# Altium project DryBox.PrjPcb
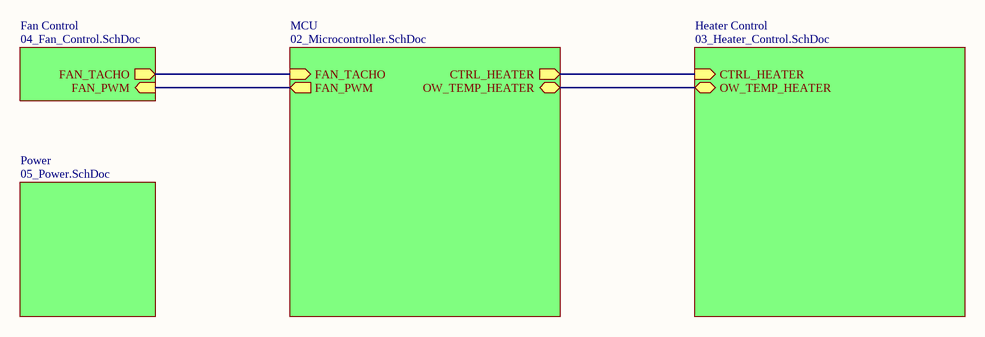
[diagram p0: 01_Top.SchDoc]
revision: 1.0; sk_ProjectName: DIY Dry Box
3 sheets, 36 parts. Net scope: hierarchical (ports join the sheet entries above them; power ports are global).
Board file: DryBox.PcbDoc
Sheets:
  01_Top.SchDoc
    MCU = 02_Microcontroller.SchDoc
    Power = 05_Power.SchDoc

## Sheet 01_Top.SchDoc
size A4; Author: Sasa Karanovic; Organization: Altium Limited; sk_Title: Block diagram; DocumentNumber: 1; Revision: 1.0; SheetNumber: 1; SheetTotal: 5

### Sub-sheets
Fan Control = 04_Fan_Control.SchDoc (file not in this document): FAN_TACHO (out), FAN_PWM (in)
Heater Control = 03_Heater_Control.SchDoc (file not in this document): CTRL_HEATER (in), OW_TEMP_HEATER (bidir)
MCU = 02_Microcontroller.SchDoc: CTRL_HEATER (out), FAN_TACHO (in), FAN_PWM (out), OW_TEMP_HEATER (bidir)
Power = 05_Power.SchDoc: no entries

### Nets
CTRL_HEATER: sheet MCU/CTRL_HEATER, sheet Heater Control/CTRL_HEATER
FAN_PWM: sheet MCU/FAN_PWM, sheet Fan Control/FAN_PWM
FAN_TACHO: sheet MCU/FAN_TACHO, sheet Fan Control/FAN_TACHO
OW_TEMP_HEATER: sheet MCU/OW_TEMP_HEATER, sheet Heater Control/OW_TEMP_HEATER

### Notes on the sheet
- Page
- Title
- www.SasaKaranovic.com <http://www.SasaKaranovic.com>
- of

## Sheet 02_Microcontroller.SchDoc
size A4; Author: Sasa Karanovic; Organization: Altium Limited; sk_Title: Microcontroller; DocumentNumber: 1; Revision: 1.0; SheetNumber: 2; SheetTotal: 5
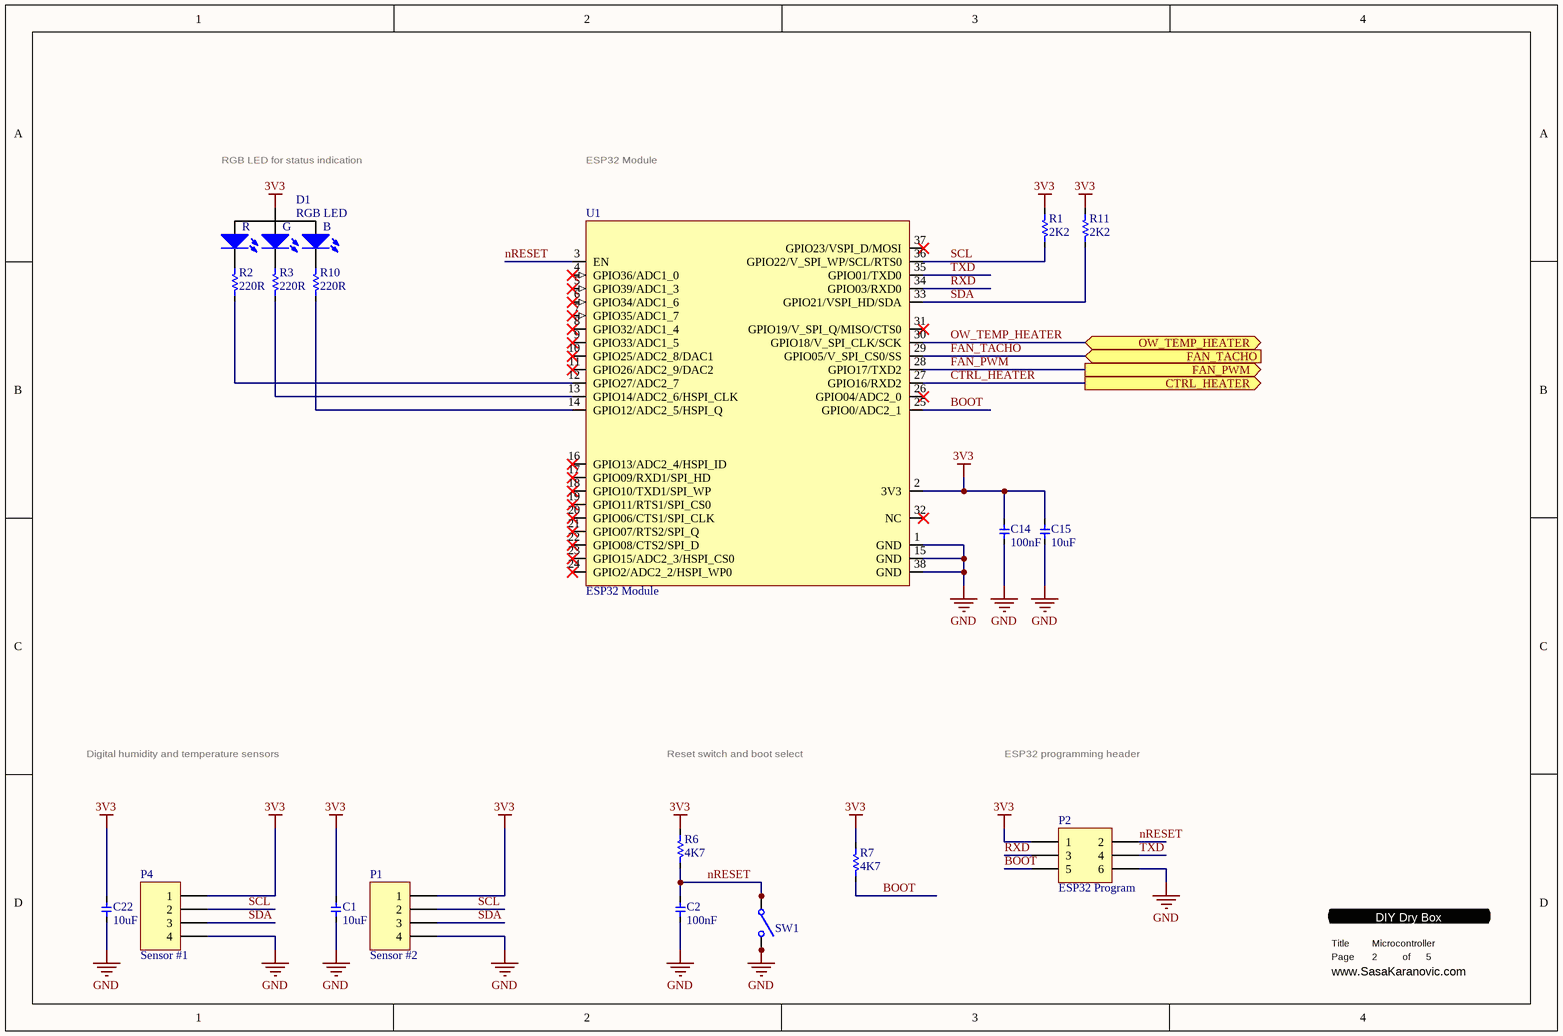
[diagram p1: 02_Microcontroller.SchDoc]

### Parts
C1  value 10uF  [0603 - CAP HS]  (hidden comment: Cap)
C2  value 100nF  [0603 - CAP HS]  (hidden comment: Cap)
C14  value 100nF  [0603 - CAP HS]  (hidden comment: Cap)
C15  value 10uF  [0603 - CAP HS]  (hidden comment: Cap)
C22  value 10uF  [0603 - CAP HS]  (hidden comment: Cap)
D1  RGB LED  [RGB LED - 0606 (1616 Metric)]
P1  Sensor #2  [Header 4x1]
P2  ESP32 Program  [HDR2X3]
P4  Sensor #1  [Header 4x1]
R1  value 2K2  [0603 - HS]  (hidden comment: Res)
R2  value 220R  [0603 - HS]  (hidden comment: Res)
R3  value 220R  [0603 - HS]  (hidden comment: Res)
R6  value 4K7  [0603 - HS]  (hidden comment: Res)
R7  value 4K7  [0603 - HS]  (hidden comment: Res)
R10  value 220R  [0603 - HS]  (hidden comment: Res)
R11  value 2K2  [0603 - HS]  (hidden comment: Res)
SW1  SWITCH TACTILE SPST-NO 0.05A 12V  [5mm_5mm_Switch_SMT]  (value not drawn)
U1  ESP32 Module  [ESP32-WROOM-32]

### Ports
CTRL_HEATER (out), FAN_PWM (out), FAN_TACHO (in), OW_TEMP_HEATER (bidir)

### Nets
3V3: C1.1 C14.1 C15.1 C22.1 D1.4 P1.1 P2.1 P4.1 R1.2 R6.2 R7.2 R11.2 U1.2(3V3)
GND: C1.2 C2.2 C14.2 C15.2 C22.2 P1.4 P2.6 P4.4 SW1.3(COMMON2) SW1.4(COMMON2) U1.1(GND) U1.15(GND) U1.38(GND)
BOOT: P2.5 R7.1 U1.25(GPIO0/ADC2_1)
CTRL_HEATER: U1.27(GPIO16/RXD2) ; port CTRL_HEATER
FAN_PWM: U1.28(GPIO17/TXD2) ; port FAN_PWM
FAN_TACHO: U1.29(GPIO05/V_SPI_CS0/SS) ; port FAN_TACHO
nRESET: C2.1 P2.2 R6.1 SW1.1(COMMON1) SW1.2(COMMON1) U1.3(EN)
OW_TEMP_HEATER: U1.30(GPIO18/V_SPI_CLK/SCK) ; port OW_TEMP_HEATER
RXD: P2.3 U1.34(GPIO03/RXD0)
SCL: P1.2 P4.2 R1.1 U1.36(GPIO22/V_SPI_WP/SCL/RTS0)
SDA: P1.3 P4.3 R11.1 U1.33(GPIO21/VSPI_HD/SDA)
TXD: P2.4 U1.35(GPIO01/TXD0)
NetD1_1: D1.1 R2.2
NetD1_2: D1.2 R3.2
NetD1_3: D1.3 R10.2
NetR2_1: R2.1 U1.12(GPIO27/ADC2_7)
NetR3_1: R3.1 U1.13(GPIO14/ADC2_6/HSPI_CLK)
NetR10_1: R10.1 U1.14(GPIO12/ADC2_5/HSPI_Q)

Not connected (* = marked no-connect by the designer): U1 4(GPIO36/ADC1_0)* 5(GPIO39/ADC1_3)* 6(GPIO34/ADC1_6)* 7(GPIO35/ADC1_7)* 8(GPIO32/ADC1_4)* 9(GPIO33/ADC1_5)* 10(GPIO25/ADC2_8/DAC1)* 11(GPIO26/ADC2_9/DAC2)* 16(GPIO13/ADC2_4/HSPI_ID)* 17(GPIO09/RXD1/SPI_HD)* 18(GPIO10/TXD1/SPI_WP)* 19(GPIO11/RTS1/SPI_CS0)* 20(GPIO06/CTS1/SPI_CLK)* 21(GPIO07/RTS2/SPI_Q)* 22(GPIO08/CTS2/SPI_D)* 23(GPIO15/ADC2_3/HSPI_CS0)* 24(GPIO2/ADC2_2/HSPI_WP0)* 26(GPIO04/ADC2_0)* 31(GPIO19/V_SPI_Q/MISO/CTS0)* 32(NC)* 37(GPIO23/VSPI_D/MOSI)*

### Notes on the sheet
- RGB LED for status indication
- ESP32 Module
- Digital humidity and temperature sensors
- Reset switch and boot select
- ESP32 programming header
- Page
- Title
- www.SasaKaranovic.com <http://www.SasaKaranovic.com>
- of
- (in symbol EAST1616RGBB2) R; G; B

### Library data of the parts
C1 C15 C22 = Cap: Capacitor; Manufacturer: Samsung Electro-Mechanics; Manufacturer Part Number: CL10A106MO8NQNC; Distributor Part Number: 1276-1870-1-ND; Distributor: DigiKey
C2 C14 = Cap: Capacitor; Manufacturer: Samsung Electro-Mechanics; Manufacturer Part Number: CL10B103KB8NNNC; Distributor Part Number: 1276-1009-1-ND; Distributor: DigiKey
D1 = EAST1616RGBB2: Red, Green, Blue (RGB) - LED Indication - Discrete 1.9V Red, 2.8V Green, 2.8V Blue 0606 (1616 Metric); Manufacturer: Everlight Electronics Co Ltd; Manufacturer Part Number: EAST1616RGBB2; Distributor: DigiKey; Distributor Part Number: 1080-1551-1-ND
P1 P4 = Header 4: Header, 4-Pin
P2 = Header 3X2: Header, 3-Pin, Dual row
R1 R11 = Res: Resistor; Manufacturer: Stackpole Electronics Inc; Manufacturer Part Number: RMCF0603JT2K20; Distributor: DigiKey; Distributor Part Number: RMCF0603JT2K20CT-ND
R2 R3 R10 = Res: Resistor; Manufacturer: Stackpole Electronics Inc; Manufacturer Part Number: RMCF0603FT220R; Distributor: DigiKey; Distributor Part Number: RMCF0603FT220RCT-ND
R6 R7 = Res: Resistor; Manufacturer: Stackpole Electronics Inc; Manufacturer Part Number: RMCF0603FT4K70; Distributor: DigiKey; Distributor Part Number: RMCF0603FT4K70CT-ND
SW1 = PTS645SL50SMTR92 LFS: Manufacturer: C&K; Distributor Part Number: CKN9088CT-ND; Manufacturer Part Number: PTS645SL50SMTR92 LFS; Distributor: DigiKey
U1 = ESP32_Module: Manufacturer Part Number: ESP32-WROOM-32D (4MB HIGH TEMP); Manufacturer: Espressif Systems

## Sheet 05_Power.SchDoc
size A4; Author: Sasa Karanovic; Organization: Altium Limited; sk_Title: Power; DocumentNumber: 1; SheetNumber: 5; SheetTotal: 5
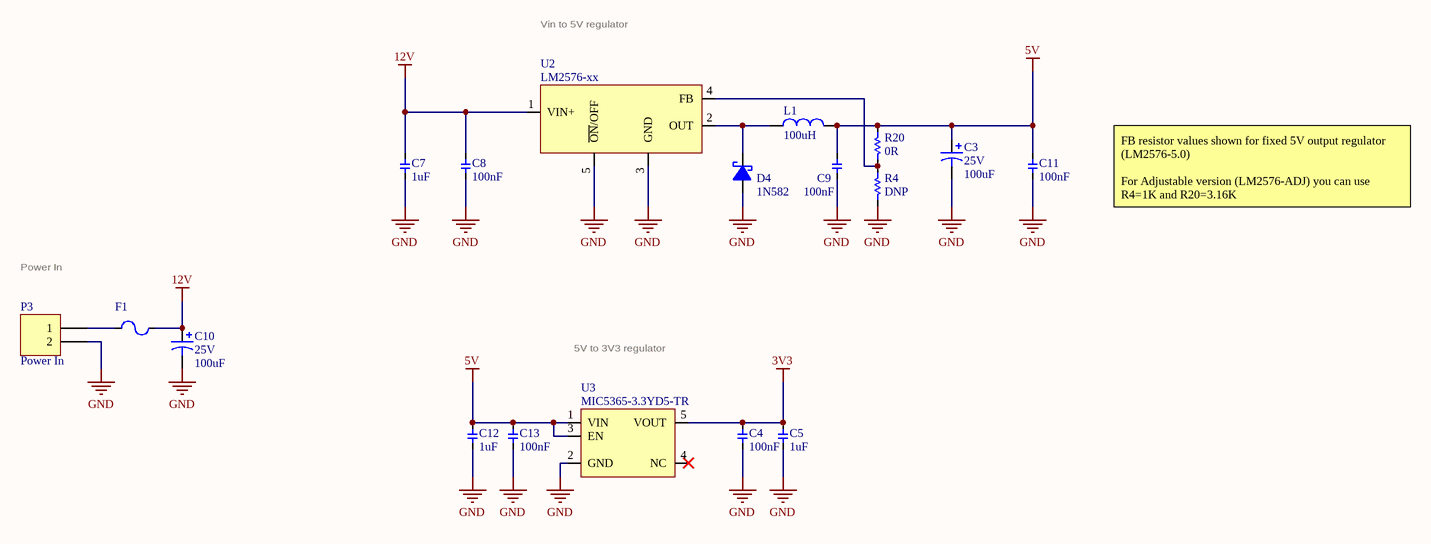
[diagram p2: 05_Power.SchDoc]

### Parts
C3  25V  value 100uF  [Electrolytic Cap 2.54mm]
C4  value 100nF  [0603 - CAP]  (hidden comment: Cap)
C5  value 1uF  [0603 - CAP]  (hidden comment: Cap)
C7  value 1uF  [0603 - CAP]  (hidden comment: Cap)
C8  value 100nF  [0603 - CAP]  (hidden comment: Cap)
C9  value 100nF  [0603 - CAP]  (hidden comment: Cap)
C10  25V  value 100uF  [Electrolytic Cap 2.54mm]
C11  value 100nF  [0603 - CAP]  (hidden comment: Cap)
C12  value 1uF  [0603 - CAP]  (hidden comment: Cap)
C13  value 100nF  [0603 - CAP]  (hidden comment: Cap)
D4  1N582  [SOD123F]
F1  Fuse Thermal  [1812F]  (value not drawn)
L1  value 100uH  [IND_TH_SMD]  (hidden comment: Inductor)
P3  Power In  [Header 2x1]
R4  value DNP  [0603 - HS]  (hidden comment: Res)  (no BOM)
R20  value 0R  [0603 - HS]  (hidden comment: Res)
U2  LM2576-xx  [TO263-5]
U3  MIC5365-3.3YD5-TR  [SOT-23-5 - duplicate]

### Nets
3V3: C4.2 C5.2 U3.5(VOUT)
5V: C3.1 C9.2 C11.2 C12.2 C13.2 L1.2 R20.2 U3.1(VIN) U3.3(EN)
12V: C7.2 C8.2 C10.1 F1.1 U2.1(VIN+)
GND: C3.2 C4.1 C5.1 C7.1 C8.1 C9.1 C10.2 C11.1 C12.1 C13.1 D4.A P3.2 R4.1 U2.3(GND) U2.5(~{ON}/OFF) U3.2(GND)
NetD4_K: D4.K L1.1 U2.2(OUT)
NetF1_2: F1.2 P3.1
NetR4_2: R4.2 R20.1 U2.4(FB)

Not connected (* = marked no-connect by the designer): U3 4(NC)*

### Notes on the sheet
- Vin to 5V regulator
- FB resistor values shown for fixed 5V output regulator (LM2576-5.0)
  For Adjustable version (LM2576-ADJ) you can use R4=1K and R20=3.16K
- Power In
- 5V to 3V3 regulator
- Page
- Title
- www.SasaKaranovic.com <http://www.SasaKaranovic.com>
- of

### Library data of the parts
C3 C10 = Cap Electrolytic: Polarized Capacitor (Axial); Manufacturer: Würth Elektronik; Manufacturer Part Number: 860160674021; Distributor: DigiKey; Distributor Part Number: 732-9599-1-ND
C4 C8 C9 C11 C13 = Cap: as C2 on sheet 02_Microcontroller; Distributor Part Number: 1276-1009-1-ND; Distributor: DigiKey
C5 C7 C12 = Cap: Capacitor; Manufacturer: Samsung Electro-Mechanics; Manufacturer Part Number: CL10A105KB8NNNC; Distributor Part Number: 1276-1860-1-ND; Distributor: DigiKey
D4 = Diode Schotky: Manufacturer: Nexperia USA Inc.; Manufacturer Part Number: PMEG6010CEH,115; Distributor: DigiKey; Distributor Part Number: 1727-3848-1-ND
F1 = Fuse Thermal: Thermal Fuse; Manufacturer: Bourns Inc.; Manufacturer Part Number: SF-1206SP200-2; Distributor: DigiKey; Distributor Part Number: SF-1206SP200-2CT-ND
L1 = Inductor: Manufacturer: TDK Corporation; Manufacturer Part Number: VLS6045AF-101M; Distributor: DigiKey; Distributor Part Number: 445-180842-1-ND
P3 = Header 2: Header, 2-Pin
R4 = Res: Resistor; Distributor: DigiKey
R20 = Res: Resistor; Manufacturer: Stackpole Electronics Inc; Manufacturer Part Number: RMCF0603ZT0R00; Distributor: DigiKey; Distributor Part Number: RMCF0603ZT0R00CT-ND
U2 = LM2576-xx: Switching mode regulator [ 3v3, 5v, 12v and ADJ ]; Manufacturer: Texas Instruments; Manufacturer Part Number: LM2576S-5.0/NOPB; Distributor: DigiKey; Distributor Part Number: LM2576S-5.0/NOPB-ND
U3 = MIC5365-1.8YD5-TR: IC REG LIN 3.3V 150MA TSOT23-5; Manufacturer: Microchip Technology; Manufacturer Part Number: MIC5365-3.3YD5-TR; Distributor: DigiKey; Distributor Part Number: 576-4085-1-ND

## Nets that join several sheets
3V3: 02_Microcontroller (13 pins), 05_Power (C4.2 C5.2 U3.5)
GND: 02_Microcontroller (13 pins), 05_Power (16 pins)